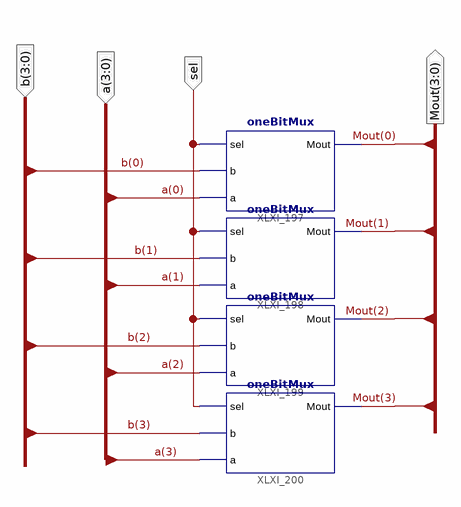
[diagram p0: schematic sheet 1]
// Xilinx ISE schematic fourBitMux.sch (spartan3e) as structural Verilog: 4 symbols, 4 ports
module fourBitMux (
  input  sel,
  input  [3:0] a,
  input  [3:0] b,
  output [3:0] Mout
);

  oneBitMux XLXI_197 (.sel(sel), .b(b[0]), .a(a[0]), .Mout(Mout[0]));
  oneBitMux XLXI_198 (.sel(sel), .b(b[1]), .a(a[1]), .Mout(Mout[1]));
  oneBitMux XLXI_199 (.sel(sel), .b(b[2]), .a(a[2]), .Mout(Mout[2]));
  oneBitMux XLXI_200 (.sel(sel), .b(b[3]), .a(a[3]), .Mout(Mout[3]));
endmodule
